# Altium schematic sheet Motor Control.SchDoc
size A4
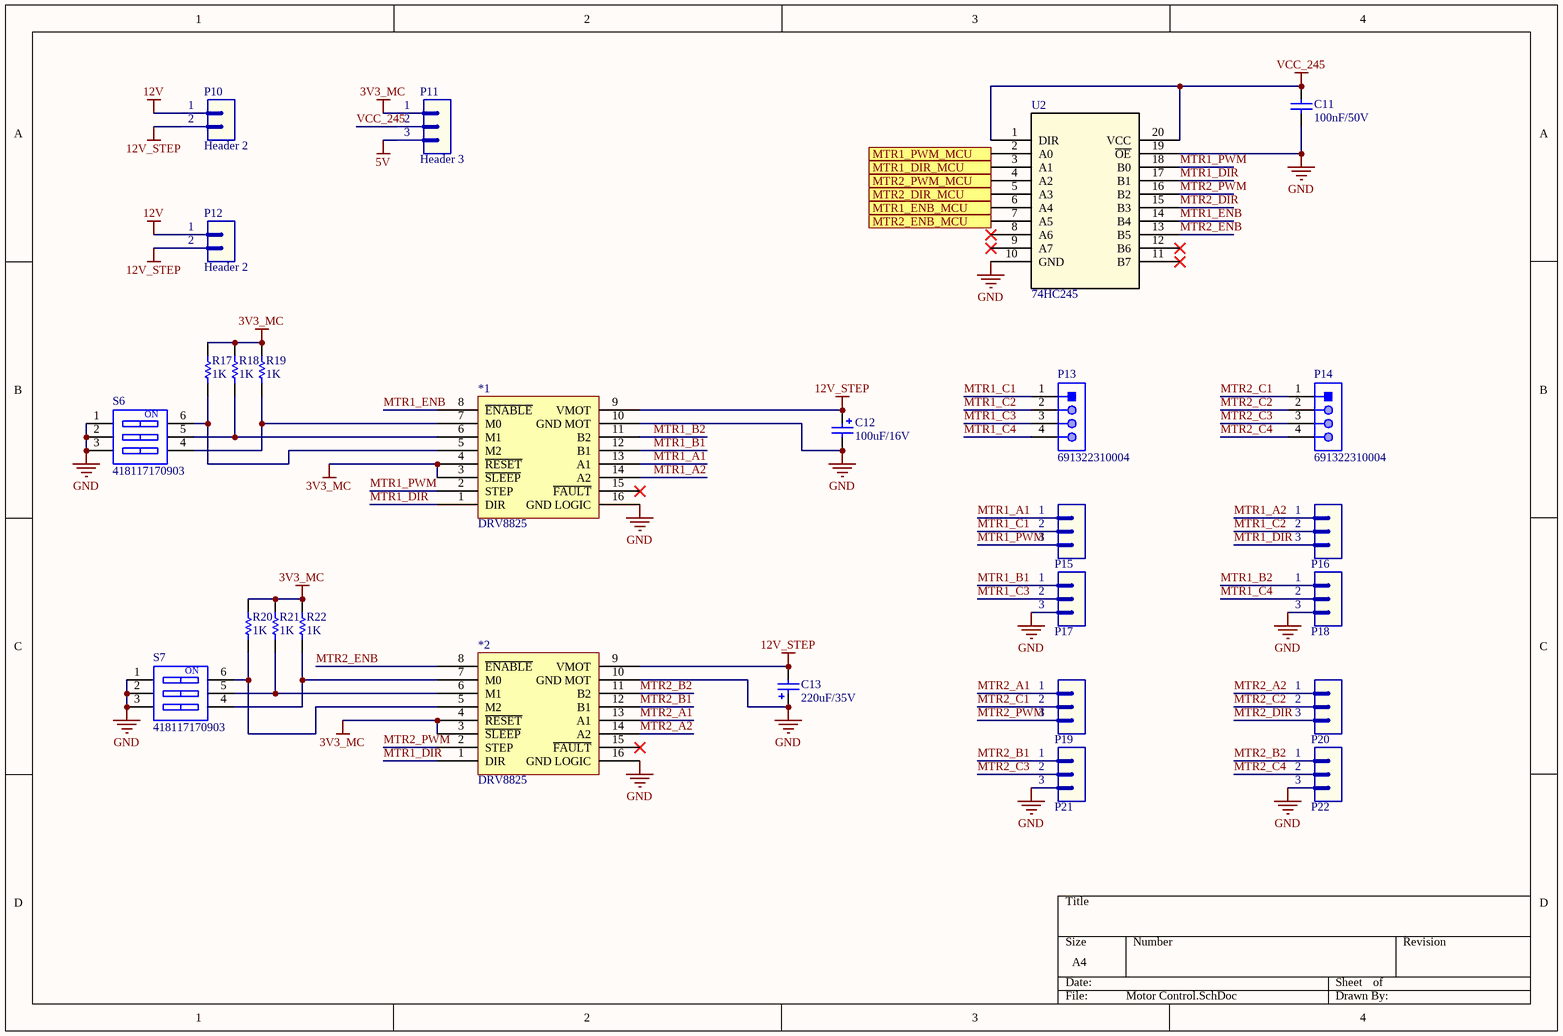
[diagram p0: Motor Control.SchDoc]

## Parts
*1  DRV8825  [DRV8825]
*2  DRV8825  [DRV8825]
C11  value 100nF/50V  [CAP-SM-0805]  (hidden comment: Cap-10uF-50V-0805)
C12  value 100uF/16V  [CAP-SM-AL-SIZE-D-D6L6]  (hidden comment: Cap-Al-100uF-16V-D6L5)
C13  value 220uF/35V  [CAP-SM-AL-SIZE-F-D8L10]  (hidden comment: Cap-Al-220uF-35V-D8L10)
P10  Header 2  [JP2]
P11  Header 3  [JP3]
P12  Header 2  [JP2]
P13  691322310004  [691322310004]
P14  691322310004  [691322310004]
P15  Header 3  [JP3]  (value not drawn)
P16  Header 3  [JP3]  (value not drawn)
P17  Header 3  [JP3]  (value not drawn)
P18  Header 3  [JP3]  (value not drawn)
P19  Header 3  [JP3]  (value not drawn)
P20  Header 3  [JP3]  (value not drawn)
P21  Header 3  [JP3]  (value not drawn)
P22  Header 3  [JP3]  (value not drawn)
R17  value 1K  [RES-SM-0805]  (hidden comment: Res-1K-0805)
R18  value 1K  [RES-SM-0805]  (hidden comment: Res-1K-0805)
R19  value 1K  [RES-SM-0805]  (hidden comment: Res-1K-0805)
R20  value 1K  [RES-SM-0805]  (hidden comment: Res-1K-0805)
R21  value 1K  [RES-SM-0805]  (hidden comment: Res-1K-0805)
R22  value 1K  [RES-SM-0805]  (hidden comment: Res-1K-0805)
S6  418117170903  [418117170903]
S7  418117170903  [418117170903]
U2  74HC245  [74HC245,625]

## Ports
MTR1_DIR_MCU (in), MTR1_ENB_MCU (in), MTR1_PWM_MCU (in), MTR2_DIR_MCU (in), MTR2_ENB_MCU (in), MTR2_PWM_MCU (in)

## Nets
3V3_MC: *1.3(~{SLEEP}) *1.4(~{RESET}) *2.3(~{SLEEP}) *2.4(~{RESET}) P11.1 R17.2 R18.2 R19.2 R20.2 R21.2 R22.2
5V: P11.3
12V: P10.1 P12.1
12V_STEP: *1.9(VMOT) *2.9(VMOT) C12.1 C13.2 P10.2 P12.2
GND: *1.10(GND_MOT) *1.16(GND_LOGIC) *2.10(GND_MOT) *2.16(GND_LOGIC) C11.1 C12.2 C13.1 P17.3 P18.3 P21.3 P22.3 S6.1 S6.2 S6.3 S7.1 S7.2 S7.3 U2.10(GND) U2.19(~{OE})
VCC_245: C11.2 P11.2 U2.1(DIR) U2.20(VCC)
MTR1_A1: *1.13(A1) P15.1
MTR1_A2: *1.14(A2) P16.1
MTR1_B1: *1.12(B1) P17.1
MTR1_B2: *1.11(B2) P18.1
MTR1_C1: P13.1 P15.2
MTR1_C2: P13.2 P16.2
MTR1_C3: P13.3 P17.2
MTR1_C4: P13.4 P18.2
MTR1_DIR: *1.1(DIR) *2.1(DIR) P16.3 U2.17(B1)
MTR1_DIR_MCU: U2.3(A1) ; port MTR1_DIR_MCU
MTR1_ENB: *1.8(~{ENABLE}) U2.14(B4)
MTR1_ENB_MCU: U2.6(A4) ; port MTR1_ENB_MCU
MTR1_PWM: *1.2(STEP) P15.3 U2.18(B0)
MTR1_PWM_MCU: U2.2(A0) ; port MTR1_PWM_MCU
MTR2_A1: *2.13(A1) P19.1
MTR2_A2: *2.14(A2) P20.1
MTR2_B1: *2.12(B1) P21.1
MTR2_B2: *2.11(B2) P22.1
MTR2_C1: P14.1 P19.2
MTR2_C2: P14.2 P20.2
MTR2_C3: P14.3 P21.2
MTR2_C4: P14.4 P22.2
MTR2_DIR: P20.3 U2.15(B3)
MTR2_DIR_MCU: U2.5(A3) ; port MTR2_DIR_MCU
MTR2_ENB: *2.8(~{ENABLE}) U2.13(B5)
MTR2_ENB_MCU: U2.7(A5) ; port MTR2_ENB_MCU
MTR2_PWM: *2.2(STEP) P19.3 U2.16(B2)
MTR2_PWM_MCU: U2.4(A2) ; port MTR2_PWM_MCU
Net*1_5: *1.5(M2) R17.1 S6.6
Net*1_6: *1.6(M1) R18.1 S6.5
Net*1_7: *1.7(M0) R19.1 S6.4
Net*2_5: *2.5(M2) R20.1 S7.6
Net*2_6: *2.6(M1) R21.1 S7.5
Net*2_7: *2.7(M0) R22.1 S7.4

Not connected (* = marked no-connect by the designer): *1 15(~{FAULT})*; *2 15(~{FAULT})*; U2 8(A6)* 9(A7)* 11(B7)* 12(B6)*

## Notes on the sheet
- (in symbol 418117170903) ON

## Library data of the parts
C11 = Cap-10uF-50V-0805: CAP CER 10UF 50V X5R 0805; Manufacturer: Yageo; Manufacturer Part Number: CC0805KKX5R9BB106; Local Supplier: thegioiic; Local Supplier Link: https://thegioiic.com/products/tu-10uf-50v-0805; Supplier 1: Digikey; Supplier 1 Link: https://www.digikey.com/product-detail/en/yageo/CC0805KKX5R9BB106/311-3499-2-ND/7164383; Supplier 1 Part Number: 311-3499-2-ND
C12 = Cap-Al-100uF-16V-D6L5: CAP ALUM 100UF 20% 16V SMD; Manufacturer: Nichicon; Manufacturer Part Number: UWX1C101MCL1GB; Local Supplier: thegioiic; Local Supplier Link: https://thegioiic.com/products/tu-nhom-smd-100uf-16v-d6-3l5-4; Supplier 1: Digikey; Supplier 1 Part Number: 493-2105-1-ND; Supplier 1 Link: https://www.digikey.com/product-detail/en/nichicon/UWX1C101MCL1GB/493-2105-1-ND/590080
C13 = Cap-Al-220uF-35V-D8L10: CAP ALUM 220UF 20% 35V SMD; Manufacturer: Nichicon; Manufacturer Part Number: UWT1V221MNL1GS; Local Supplier: thegioiic; Local Supplier Link: https://thegioiic.com/products/tu-nhom-smd-220uf-35v-d8l10; Supplier 1: Digikey; Supplier 1 Link: https://www.digikey.com/product-detail/en/nichicon/UWT1V221MNL1GS/493-2205-2-ND/589946; Supplier 1 Part Number: 493-2205-2-ND
P10 P12 = Header 2: Header, 2-Pin; LatestRevisionDate: 17-Jul-2002; LatestRevisionNote: Re-released for DXP Platform.; Publisher: Altium Limited
P11 P15-P22 = Header 3: Header, 3-Pin; LatestRevisionDate: 17-Jul-2002; LatestRevisionNote: Re-released for DXP Platform.; Publisher: Altium Limited
P13 P14 = 691322310004: WR-TBL Serie 322 Horizontal PCB Header, Pluggable, pitch 3.81mm, 4p; Compliance: RoHS; Modularity: No; Pin Number: 4; Rated Current [UL]: 10A; Working Voltage [UL]: 300VAC; ComponentLink1Description: Manufacturer; ComponentLink1URL: http://www.we-online.de; ComponentLink2URL: https://katalog.we-online.de/em/datasheet/691322310004.pdf; ComponentLink2Description: Datasheet; Mounting Technology: THT; Part Number: 691322310004; Packaging: Box; Operating Temperature: -40 to +105degC; PCB/Cable/Panel: PCB; Pitch: 3.81mm; Published Date: October 2019; Type: Horizontal; Publisher: Wurth Elektronik; Application: Pluggable
R17-R22 = Res-1K-0805: RES 1K OHM 1% 1/4W 0805; Manufacturer: Stackpole Electronics Inc; Manufacturer Part Number: RNCP0805FTD1K00; Local Supplier: thegioiic; Local Supplier Link: https://thegioiic.com/products/dien-tro-1k-ohm-0805-5; Supplier 1: Digikey; Supplier 1 Link: https://www.digikey.com/product-detail/en/stackpole-electronics-inc/RNCP0805FTD1K00/RNCP0805FTD1K00CT-ND/2240568; Supplier 1 Part Number: RNCP0805FTD1K00CT-ND
S6 S7 = 418117170903: WS-DITV Compact THT Dip Switch, Flat Actuator, pitch 2.54mm, 3p; Operation Force: 800g; Pole Number: 3; Actuator Type: Flat Type; Circuit: SPST-NO; Rated Current Switching: 25mA; Rated Current Non-Switching: 100mA; Rated Voltage Non-Switching: 50VDC; Rated Voltage Switching: 24VDC; ComponentLink1Description: Manufacturer; ComponentLink1URL: http://www.we-online.de; ComponentLink2Description: Datasheet; ComponentLink2URL: https://katalog.we-online.com/em/datasheet/418117170903.pdf; Pitch: 2.54mm; Contact Material: Copper Alloy; Mounting Technology: THT; Operating Temperature: -40 to +85degC; Contact Plating: Gold; Packaging: Tube; Part Number: 418117170903; Publisher: Wurth Elektronik; Published Date: September 2019
U2 = 74HC245: No Description Available; Vendor: Texas Instruments; Built_By: EMA_UL_Team; SourceLibrary: TI_2002-01-01_7; Manufacturer_Part_Number: 74HC245; Copyright: Copyright (C) 2018 Accelerated Designs. All rights reserved; RefDes: RefDes; Type: DEV